# EAGLE schematic hdmi_transmitter (EAGLE 7.2.0)
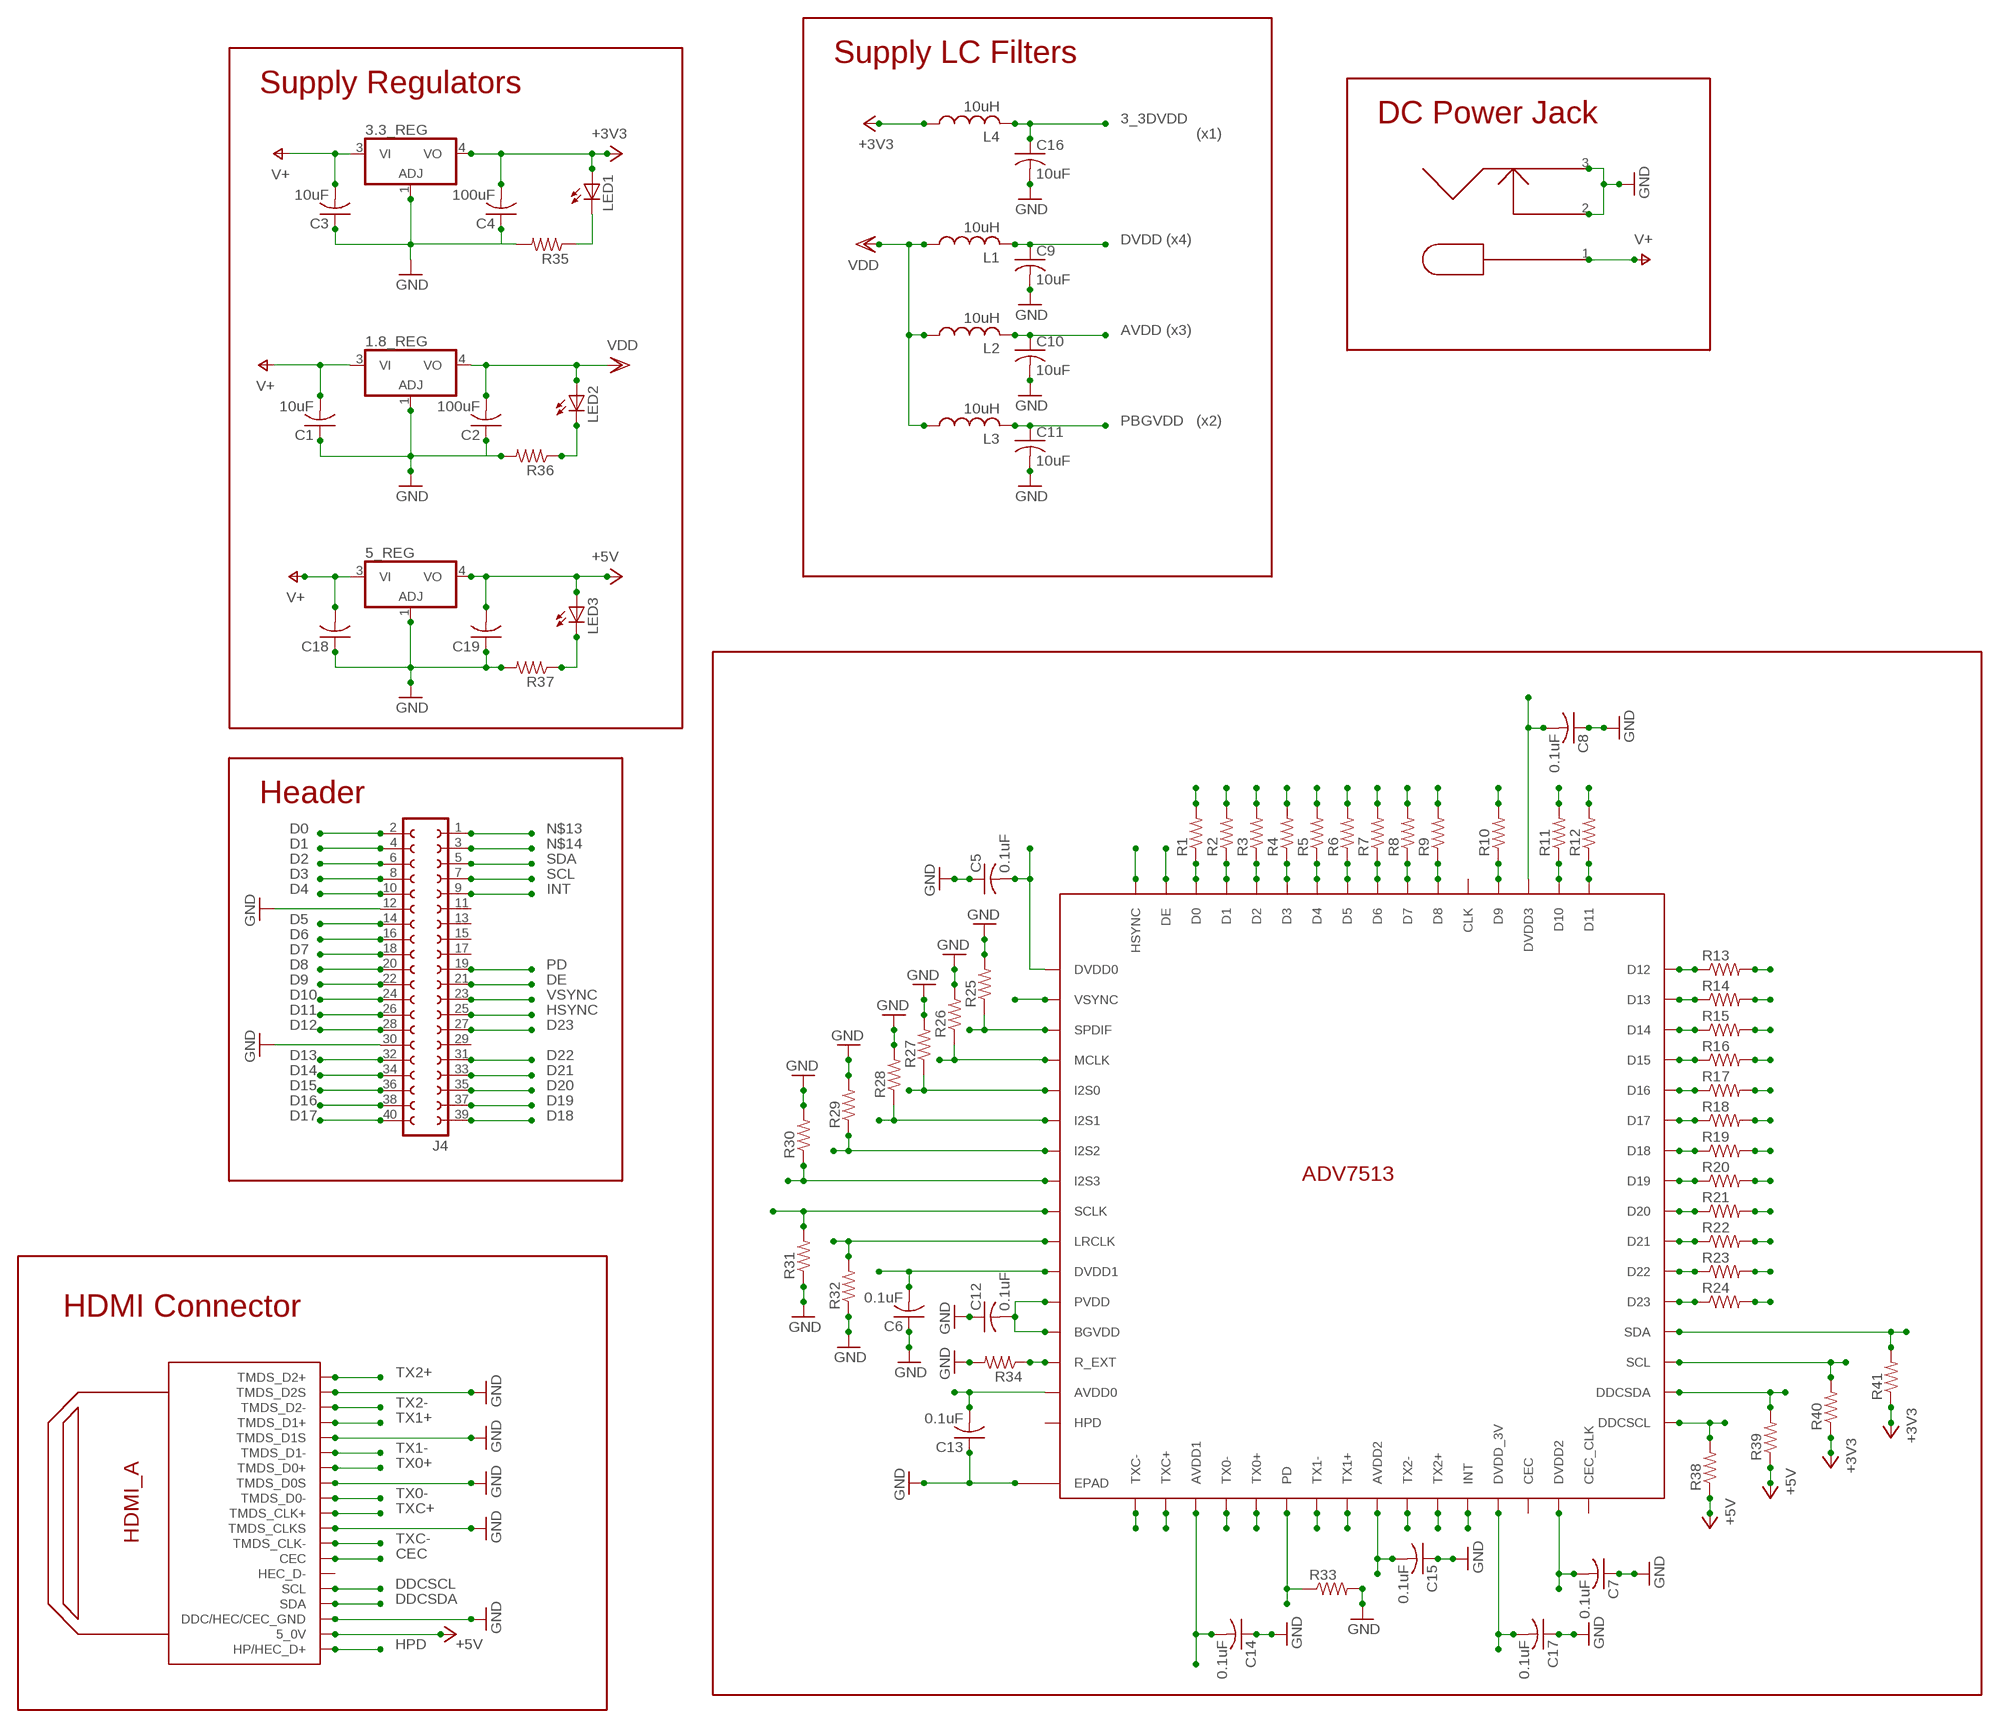
[diagram p0: schematic, sheet 1]

## Parts
1.8_REG  317EMP  [SOT223]
3.3_REG  317EMP  [SOT223]
5_REG  317EMP  [SOT223]
C1  10uF  C-USC0603  [C0603]
C2  100uF  C-USC0603  [C0603]
C3  10uF  C-USC0603  [C0603]
C4  100uF  C-USC0603  [C0603]
C5  0.1uF  C-USC0603  [C0603]
C6  0.1uF  C-USC0603  [C0603]
C7  0.1uF  C-USC0603  [C0603]
C8  0.1uF  C-USC0603  [C0603]
C9  10uF  C-USC0603  [C0603]
C10  10uF  C-USC0603  [C0603]
C11  10uF  C-USC0603  [C0603]
C12  0.1uF  C-USC0603  [C0603]
C13  0.1uF  C-USC0603  [C0603]
C14  0.1uF  C-USC0603  [C0603]
C15  0.1uF  C-USC0603  [C0603]
C16  10uF  C-USC0603  [C0603]
C17  0.1uF  C-USC0603  [C0603]
C18  C-USC0603  [C0603]
C19  C-USC0603  [C0603]
J4  FE20-2  [FE20-2]
L1  10uH  L-USL2012C  [L2012C]
L2  10uH  L-USL2012C  [L2012C]
L3  10uH  L-USL2012C  [L2012C]
L4  10uH  L-USL2012C  [L2012C]
LED1  LED5MM  [LED5MM]
LED2  LED5MM  [LED5MM]
LED3  LED5MM  [LED5MM]
R1  R-US_R0603  [R0603]
R2  R-US_R0603  [R0603]
R3  R-US_R0603  [R0603]
R4  R-US_R0603  [R0603]
R5  R-US_R0603  [R0603]
R6  R-US_R0603  [R0603]
R7  R-US_R0603  [R0603]
R8  R-US_R0603  [R0603]
R9  R-US_R0603  [R0603]
R10  R-US_R0603  [R0603]
R11  R-US_R0603  [R0603]
R12  R-US_R0603  [R0603]
R13  R-US_R0603  [R0603]
R14  R-US_R0603  [R0603]
R15  R-US_R0603  [R0603]
R16  R-US_R0603  [R0603]
R17  R-US_R0603  [R0603]
R18  R-US_R0603  [R0603]
R19  R-US_R0603  [R0603]
R20  R-US_R0603  [R0603]
R21  R-US_R0603  [R0603]
R22  R-US_R0603  [R0603]
R23  R-US_R0603  [R0603]
R24  R-US_R0603  [R0603]
R25  R-US_R0603  [R0603]
R26  R-US_R0603  [R0603]
R27  R-US_R0603  [R0603]
R28  R-US_R0603  [R0603]
R29  R-US_R0603  [R0603]
R30  R-US_R0603  [R0603]
R31  R-US_R0603  [R0603]
R32  R-US_R0603  [R0603]
R33  R-US_R0603  [R0603]
R34  R-US_R0603  [R0603]
R35  R-US_R0603  [R0603]
R36  R-US_R0603  [R0603]
R37  R-US_R0603  [R0603]
R38  R-US_R0603  [R0603]
R39  R-US_R0603  [R0603]
R40  R-US_R0603  [R0603]
R41  R-US_R0603  [R0603]
U$1  ADV7513  [LQFP-ST-64-2]
U$2  DC_BARREL_CONN  [DC_BARREL_CONN]
U$3  111RLF  [111RLF]

## Nets
3_3DVDD: C16.1 C17.2 L4.2 U$1.29(DVDD_3V)
+3V3: 3.3_REG.4(VO) C4.2 L4.1 LED1.A R40.1 R41.1
+5V: 5_REG.4(VO) C19.2 LED3.A R38.1 R39.1 U$3.18(5_0V)
AVDD: C10.1 C13.2 C14.2 C15.2 L2.2 U$1.15(AVDD0) U$1.19(AVDD1) U$1.25(AVDD2)
CEC: U$3.13(CEC)
D0: J4.2 R1.2
D1: J4.4 R2.2
D2: J4.6 R3.2
D3: J4.8 R4.2
D4: J4.10 R5.2
D5: J4.14 R6.2
D6: J4.16 R7.2
D7: J4.18 R8.2
D8: J4.20 R9.2
D9: J4.22 R10.2
D10: J4.24 R11.2
D11: J4.26 R12.2
D12: J4.28 R13.2
D13: J4.32 R14.2
D14: J4.34 R15.2
D15: J4.36 R16.2
D16: J4.38 R17.2
D17: J4.40 R18.2
D18: J4.39 R19.2
D19: J4.37 R20.2
D20: J4.35 R21.2
D21: J4.33 R22.2
D22: J4.31 R23.2
D23: J4.27 R24.2
DDCSCL: R38.2 U$1.33(DDCSCL) U$3.15(SCL)
DDCSDA: R39.2 U$1.34(DDCSDA) U$3.16(SDA)
DE: J4.21 U$1.63(DE)
DVDD: C5.2 C6.2 C7.2 C8.2 C9.1 L1.2 U$1.1(DVDD0) U$1.11(DVDD1) U$1.31(DVDD2) U$1.51(DVDD3)
GND: 1.8_REG.1(ADJ) 3.3_REG.1(ADJ) 5_REG.1(ADJ) C1.1 C2.1 C3.1 C4.1 C5.1 C6.1 C7.1 C8.1 C9.2 C10.2 C11.2 C12.1 C13.1 C14.1 C15.1 C16.2 C17.1 C18.1 C19.1 J4.12 J4.30 R25.2 R26.2 R27.2 R28.2 R29.2 R30.2 R31.1 R32.1 R33.2 R34.2 R35.2 R36.2 R37.2 U$1.0(EPAD) U$2.2 U$2.3 U$3.2(TMDS_D2S) U$3.5(TMDS_D1S) U$3.8(TMDS_D0S) U$3.11(TMDS_CLKS) U$3.17(DDC/HEC/CEC_GND)
HPD: U$3.19(HP/HEC_D+)
HSYNC: J4.25 U$1.64(HSYNC)
I2S0: R27.1 U$1.5(I2S0)
I2S1: R28.1 U$1.6(I2S1)
I2S2: R29.1 U$1.7(I2S2)
I2S3: R30.1 U$1.8(I2S3)
INT: J4.9 U$1.28(INT)
LRCLK: R32.2 U$1.10(LRCLK)
MCLK: R26.1 U$1.4(MCLK)
N$1: R13.1 U$1.48(D12)
N$2: R14.1 U$1.47(D13)
N$3: R15.1 U$1.46(D14)
N$4: R16.1 U$1.45(D15)
N$5: R17.1 U$1.44(D16)
N$6: R18.1 U$1.43(D17)
N$7: R19.1 U$1.42(D18)
N$8: R20.1 U$1.41(D19)
N$9: R21.1 U$1.40(D20)
N$10: R22.1 U$1.39(D21)
N$11: R23.1 U$1.38(D22)
N$12: R24.1 U$1.37(D23)
N$13: J4.1
N$14: J4.3
N$16: R34.1 U$1.14(R_EXT)
N$17: R1.1 U$1.62(D0)
N$18: R2.1 U$1.61(D1)
N$19: R3.1 U$1.60(D2)
N$20: R4.1 U$1.59(D3)
N$21: R5.1 U$1.58(D4)
N$22: R6.1 U$1.57(D5)
N$23: R7.1 U$1.56(D6)
N$24: R8.1 U$1.55(D7)
N$25: R9.1 U$1.54(D8)
N$26: R10.1 U$1.52(D9)
N$27: R11.1 U$1.50(D10)
N$28: R12.1 U$1.49(D11)
N$29: LED1.K(C) R35.1
N$32: LED2.K(C) R36.1
N$35: LED3.K(C) R37.1
PBGVDD: C11.1 C12.2 L3.2 U$1.12(PVDD) U$1.13(BGVDD)
PD: J4.19 R33.1 U$1.22(PD)
SCL: J4.7 R40.2 U$1.35(SCL)
SCLK: R31.2 U$1.9(SCLK)
SDA: J4.5 R41.2 U$1.36(SDA)
SPDIF: R25.1 U$1.3(SPDIF)
TX0+: U$1.21(TX0+) U$3.7(TMDS_D0+)
TX0-: U$1.20(TX0-) U$3.9(TMDS_D0-)
TX1+: U$1.24(TX1+) U$3.4(TMDS_D1+)
TX1-: U$1.23(TX1-) U$3.6(TMDS_D1-)
TX2+: U$1.27(TX2+) U$3.1(TMDS_D2+)
TX2-: U$1.26(TX2-) U$3.3(TMDS_D2-)
TXC+: U$1.18(TXC+) U$3.10(TMDS_CLK+)
TXC-: U$1.17(TXC-) U$3.12(TMDS_CLK-)
V+: 1.8_REG.3(VI) 3.3_REG.3(VI) 5_REG.3(VI) C1.2 C3.2 C18.2 U$2.1
VDD: 1.8_REG.4(VO) C2.2 L1.1 L2.1 L3.1 LED2.A
VSYNC: J4.23 U$1.2(VSYNC)
Unconnected: J4.11 J4.13 J4.15 J4.17 J4.29 U$1.16(HPD) U$1.30(CEC) U$1.32(CEC_CLK) U$1.53(CLK) U$3.14(HEC_D-)

## Notes on the sheet
- Supply LC Filters
- Supply Regulators
- DC Power Jack
- (x1)
- (x4)
- (x3)
- (x2)
- Header
- HDMI Connector

## Library data of the parts
1.8_REG 3.3_REG 5_REG = linear:*317: Positive VOLTAGE REGULATOR
C1-C19 = rcl:C-US: CAPACITOR, American symbol
J4 = con-lsta:FE20-2: FEMALE HEADER
L1-L4 = rcl:L-US: INDUCTOR, American symbol
LED1-LED3 = led:LED: LED OSRAM: - CHIPLED LG R971, LG N971, LY N971, LG Q971, LY Q971, LO R971, LY R971 LH N974, LH R974 LS Q976, LO Q976, LY Q976 LO Q996 - Hyper CHIPLED LW Q18S LB Q993, LB Q99A, LB R99A - SideLED LS A670, LO A670, LY A670, LG A670, LP A670 LB A673, LV A673, LT A673, LW A673 LH A674 LY A675 LS A676, LA A676, LO A676, LY A676, LW A676 LS A679, LY A679, LG A679 - Hyper Micro SIDELED® LS Y876, LA Y876, LO Y876, LY Y876 LT Y87S - SmartLED LW L88C, LW L88S LB L89C, LB L89S, LG L890 LS L89K, LO L89K, LY L89K LS L896, LA L896, LO L896, LY L896 - TOPLED LS T670, LO T670, LY T670, LG T670, LP T670 LSG T670, LSP T670, LSY T670, LOP T670, LYG T670 LG T671, LOG T671, LSG T671 LB T673, LV T673, LT T673, LW T673 LH T674 LS T676, LA T676, LO T676, LY T676, LB T676, LH T676, LSB T676, LW T676 LB T67C, LV T67C, LT T67C, LS T67K, LO T67K, LY T67K, LW E67C LS E67B, LA E67B, LO E67B, LY E67B, LB E67C, LV E67C, LT E67C LW T67C LS T679, LY T679, LG T679 LS T770, LO T770, LY T770, LG T770, LP T770 LB T773, LV T773, LT T773, LW T773 LH T774 LS E675, LA E675, LY E675, LS T675 LS T776, LA T776, LO T776, LY T776, LB T776 LHGB T686 LT T68C, LB T68C - Hyper Mini TOPLED® LB M676 - Mini TOPLED Santana® LG M470 LS M47K, LO M47K, LY M47K Source: http://www.osram.convergy.de LUXEON: - LUMILED® LXK2-PW12-R00, LXK2-PW12-S00, LXK2-PW14-U00, LXK2-PW14-V00 LXK2-PM12-R00, LXK2-PM12-S00, LXK2-PM14-U00 LXK2-PE12-Q00, LXK2-PE12-R00, LXK2-PE12-S00, LXK2-PE14-T00, LXK2-PE14-U00 LXK2-PB12-K00, LXK2-PB12-L00, LXK2-PB12-M00, LXK2-PB14-N00, LXK2-PB14-P00, LXK2-PB14-Q00 LXK2-PR12-L00, LXK2-PR12-M00, LXK2-PR14-Q00, LXK2-PR14-R00 LXK2-PD12-Q00, LXK2-PD12-R00, LXK2-PD12-S00 LXK2-PH12-R00, LXK2-PH12-S00 LXK2-PL12-P00, LXK2-PL12-Q00, LXK2-PL12-R00 Source: www.luxeon.com KINGBRIGHT: KA-3528ASYC Source: www.kingbright.com
R1-R41 = rcl:R-US_: RESISTOR, American symbol
U$1 = cchow_2014:ADV7513
U$2 = cchow_2014:DC_BARREL_CONN
U$3 = cchow_2014:111RLF